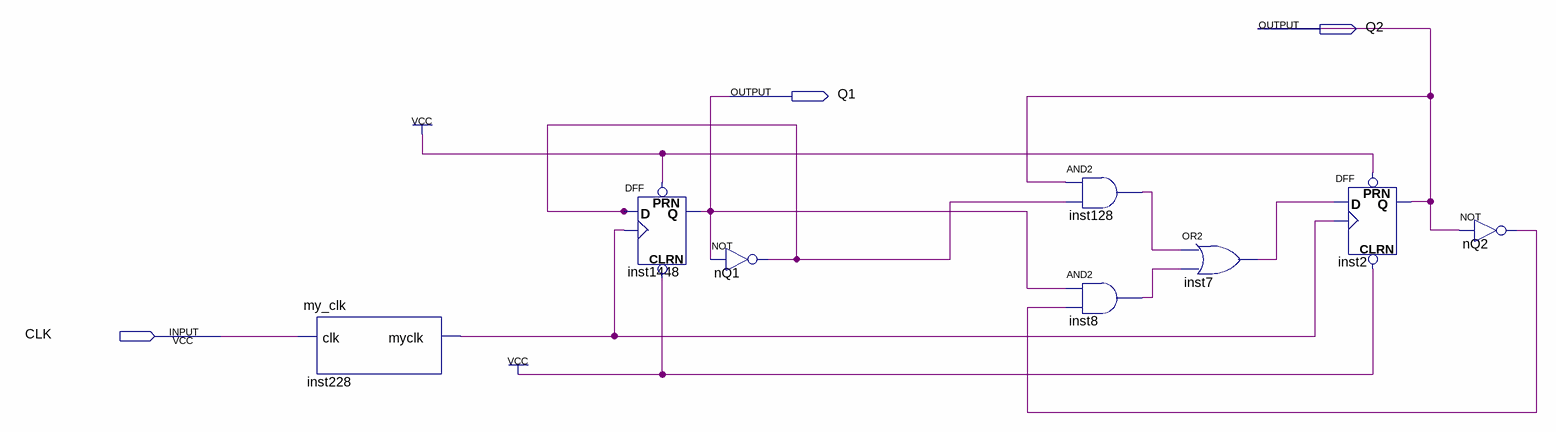
[diagram p0: schematic sheet]
// Quartus schematic count_mod4_altera.bdf as structural Verilog: 8 symbols, 3 pins
module count_mod4_altera (
  input  CLK,
  output Q2,
  output Q1
);

  wire inst7_out, inst8_out, inst128_out, inst228_myclk, nQ1_out, nQ2_out;

  my_clk inst228 (.clk(CLK), .myclk(inst228_myclk));
  DFF inst1448 (.CLRN(1'b1), .CLK(inst228_myclk), .D(nQ1_out), .PRN(1'b1), .Q(Q1));
  not nQ1 (nQ1_out, Q1);
  and inst128 (inst128_out, Q2, nQ1_out);
  and inst8 (inst8_out, Q1, nQ2_out);
  or inst7 (inst7_out, inst128_out, inst8_out);
  DFF inst2 (.CLRN(1'b1), .CLK(inst228_myclk), .D(inst7_out), .PRN(1'b1), .Q(Q2));
  not nQ2 (nQ2_out, Q2);
endmodule
